# Altium project PCB_Project.PrjPcb
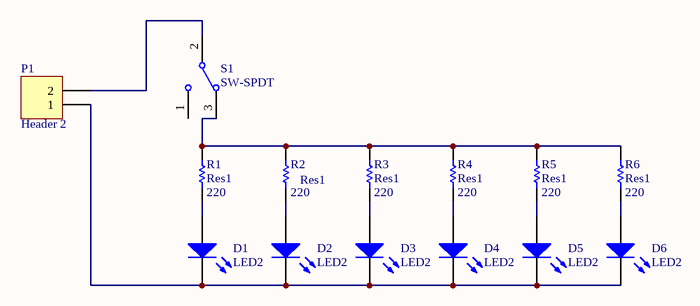
[diagram p0: Sheet1.SchDoc]
1 sheet, 14 parts. Net scope: global (net labels, ports and power ports of the same name join across sheets).
Board file: PCB1.PcbDoc

## Sheet Sheet1.SchDoc
size A4

### Parts
D1  LED2  [AXIAL-0.3]
D2  LED2  [AXIAL-0.3]
D3  LED2  [AXIAL-0.3]
D4  LED2  [AXIAL-0.3]
D5  LED2  [AXIAL-0.3]
D6  LED2  [AXIAL-0.3]
P1  Header 2  [HDR1X2]
R1  Res1  value 220  [AXIAL-0.3]
R2  Res1  value 220  [AXIAL-0.3]
R3  Res1  value 220  [AXIAL-0.3]
R4  Res1  value 220  [AXIAL-0.3]
R5  Res1  value 220  [AXIAL-0.3]
R6  Res1  value 220  [AXIAL-0.3]
S1  SW-SPDT  [TL36WW15050]

### Nets
NetD1_1: D1.1(A) R1.1
NetD1_2: D1.2(K) D2.2(K) D3.2(K) D4.2(K) D5.2(K) D6.2(K) P1.1
NetD2_1: D2.1(A) R2.1
NetD3_1: D3.1(A) R3.1
NetD4_1: D4.1(A) R4.1
NetD5_1: D5.1(A) R5.1
NetD6_1: D6.1(A) R6.1
NetP1_2: P1.2 S1.2
NetR1_2: R1.2 R2.2 R3.2 R4.2 R5.2 R6.2 S1.3

Not connected (* = marked no-connect by the designer): S1 1

### Library data of the parts
D1-D6 = LED2: Typical RED, GREEN, YELLOW, AMBER GaAs LED; Published: 8-Jun-2000; LatestRevisionDate: 17-Jul-2002; LatestRevisionNote: Re-released for DXP Platform.; PackageVersion: Feb-2002; PackageReference: 3.2X1.6X1.1; Publisher: Altium Limited; PackageDescription: SM LED; 2 Flat Leads
P1 = Header 2: Header, 2-Pin; LatestRevisionDate: 17-Jul-2002; LatestRevisionNote: Re-released for DXP Platform.; Publisher: Altium Limited
R1-R6 = Res1: Resistor; Published: 8-Jun-2000; LatestRevisionDate: 17-Jul-2002; LatestRevisionNote: Re-released for DXP Platform.; PackageReference: AXIAL-0.3; Publisher: Altium Limited; PackageDescription: Axial Device, Thru-Hole; 2 Leads; 0.3 in Pin Spacing
S1 = SW-SPDT: SPDT Subminiature Toggle Switch, Right Angle Mounting, Vertical Actuation; Published: 24-Mar-1999; LatestRevisionDate: 17-Dec-2003; LatestRevisionNote: Schematic revised, PCB Footprint replaced.; DatasheetVersion: 05-Dec-2000; PackageReference: TL36WW15050; Publisher: Altium Limited; PackageDescription: Switch; 4 Leads; ComponentLink1Description: Manufacturer Link; ComponentLink1URL: http://www.apem.com